# Altium schematic sheet RFID_Reader.SchDoc
size 297 x 209 mm; SheetNumber: 4; SheetTotal: 6
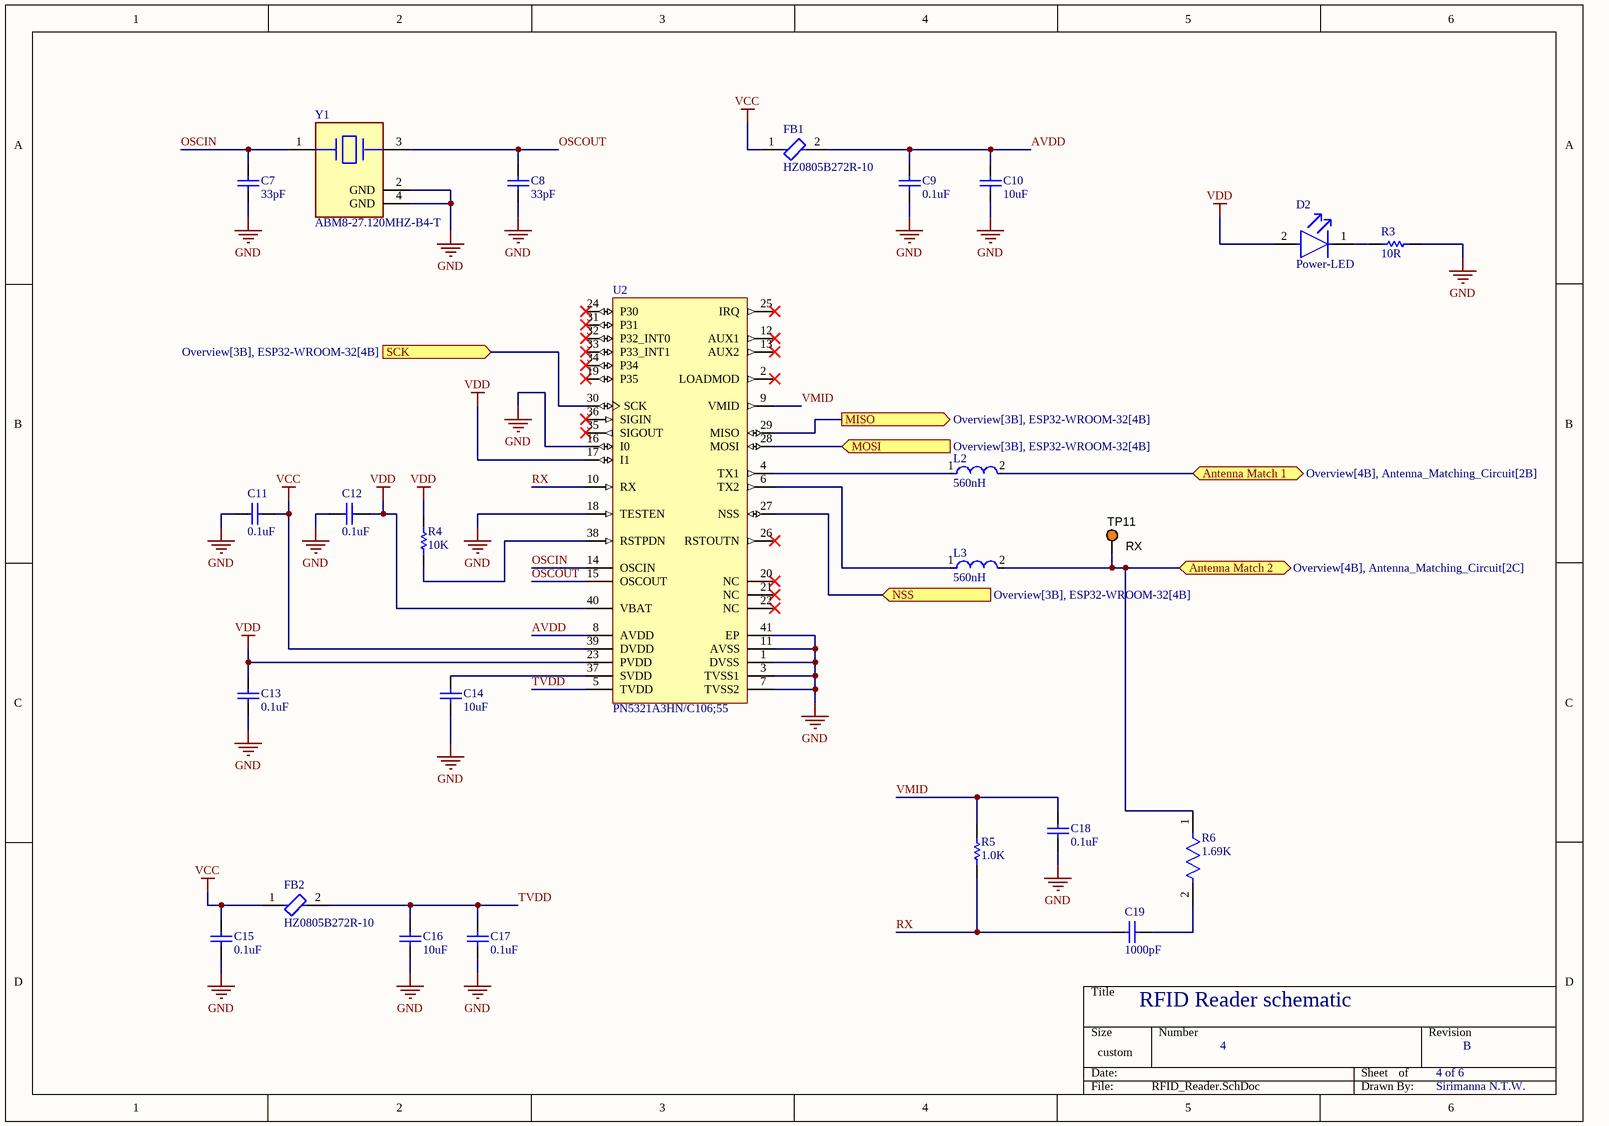
[diagram p0: RFID_Reader.SchDoc]

## Parts
C7  33pF  [CAPC2013X135X45NL10T25]
C8  33pF  [CAPC2013X135X45NL10T25]
C9  0.1uF  [CAPC2013X135X45NL10T25]
C10  10uF  [CAPC2013X135X45NL10T25]
C11  0.1uF  [CAPC2013X135X45NL10T25]
C12  0.1uF  [CAPC2013X135X45NL10T25]
C13  0.1uF  [CAPC2013X135X45NL10T25]
C14  10uF  [CAPC2013X135X45NL10T25]
C15  0.1uF  [CAPC2013X135X45NL10T25]
C16  10uF  [CAPC2013X135X45NL10T25]
C17  0.1uF  [CAPC2013X135X45NL10T25]
C18  0.1uF  [CAPC2013X135X45NL10T25]
C19  1000pF  [CAPC2013X135X45NL10T25]
D2  Power-LED  [FP-6_544-5255_01-4-MFG]
FB1  HZ0805B272R-10  [FP-MPZ2012-MFG]
FB2  HZ0805B272R-10  [FP-MPZ2012-MFG]
L2  560nH  [FP-LQM21DN_00-IPC_C]
L3  560nH  [FP-LQM21DN_00-IPC_C]
R3  10R  [RESC2013X60X35ML10T20]
R4  10K  [RESC2013X60X35NL10T20]
R5  1.0K  [RESC2013X50X30NL20T20]
R6  1.69K  [FP-CRCW0805-e3-MFG]
TP11  RX  [KSTN-5003]
U2  PN5321A3HN/C106;55  [NXP-HVQFN-40_L]
Y1  ABM8-27.120MHZ-B4-T  [FP-ABM8-MFG]

## Ports
Antenna Match 1 (bidir, see Overview[4B], Antenna_Matching_Circuit[2B]), Antenna Match 2 (bidir, see Overview[4B], Antenna_Matching_Circuit[2C]), MISO (out, see Overview[3B], ESP32-WROOM-32[4B]), MOSI (in, see Overview[3B], ESP32-WROOM-32[4B]), NSS (in, see Overview[3B], ESP32-WROOM-32[4B]), SCK (in, see Overview[3B], ESP32-WROOM-32[4B])

## Nets
GND: C7.1 C8.1 C9.1 C10.1 C11.2 C12.2 C13.1 C14.1 C15.1 C16.1 C17.1 C18.1 R3.2 U2.1(DVSS) U2.3(TVSS1) U2.7(TVSS2) U2.11(AVSS) U2.16(I0) U2.18(TESTEN) U2.41(EP) Y1.2(GND) Y1.4(GND)
VCC: C11.1 C15.2 FB1.1 FB2.1 U2.39(DVDD)
VDD: C12.1 C13.2 D2.2(A) R4.2 U2.17(I1) U2.23(PVDD) U2.40(VBAT)
Antenna Match 1: L2.2 ; port Antenna Match 1
Antenna Match 2: L3.2 R6.1 TP11.1 ; port Antenna Match 2
AVDD: C9.2 C10.2 FB1.2 U2.8(AVDD)
MISO: U2.29(MISO) ; port MISO
MOSI: U2.28(MOSI) ; port MOSI
NSS: U2.27(NSS) ; port NSS
OSCIN: C7.2 U2.14(OSCIN) Y1.1
OSCOUT: C8.2 U2.15(OSCOUT) Y1.3
RX: C19.1 R5.1 U2.10(RX)
SCK: U2.30(SCK) ; port SCK
TVDD: C16.2 C17.2 FB2.2 U2.5(TVDD)
VMID: C18.2 R5.2 U2.9(VMID)
NetC14_2: C14.2 U2.37(SVDD)
NetC19_2: C19.2 R6.2
NetD2_1: D2.1(C) R3.1
NetL2_1: L2.1 U2.4(TX1)
NetL3_1: L3.1 U2.6(TX2)
NetR4_1: R4.1 U2.38(RSTPDN)

Not connected (* = marked no-connect by the designer): U2 2(LOADMOD)* 12(AUX1)* 13(AUX2)* 19(P35)* 20(NC)* 21(NC)* 22(NC)* 24(P30)* 25(IRQ)* 26(RSTOUTN)* 31(P31)* 32(P32_INT0)* 33(P33_INT1)* 34(P34)* 35(SIGOUT)* 36(SIGIN)*

## Notes on the sheet
- RFID Reader schematic
- 4
- 4 of 6
- B
- Sirimanna N.T.W.

## Library data of the parts
C7-C19 = CMP-2100-03644-1: Chip Capacitor, 0.1 uF, +/- 10%, 50 V, -55 to 125 degC, 0805 (2012 Metric), RoHS, Tape and Reel; Manufacturer: Murata; Voltage: 50V; Capacitance: 100nF; Insulation Resistance: 10GR; Dielectric Material: Ceramic; Dielectric: X7R; Package Description: 2-Pin Surface Mount Device, Body 2 x 1.25 mm; Manufacturer URL: http://www.murata.com/; Case Code (Imperial): 0805; Datasheet URL: http://psearch.en.murata.com/capacitor/product/GRM21BR71H104KA01%23.pdf; Termination: SMD/SMT; Lead Free: LeadFree; Package Quantity: 1; Mount: SurfaceMount; REACH SVHC: Unknown; Thickness: 0.053inch; Height: 1.25mm; Case/Package: 0805; Voltage Rating: 50V; Width: 0.049inch; Case Code (Metric): 2012; Material: Ceramic; Min Operating Temperature: -55degC; RoHSCompliant: true; Datasheet Version: 42675.0; Voltage Rating (DC): 50V; Tolerance: 10%; Package Reference: 0805; Depth: 1.25mm; Length: 2mm; Max Operating Temperature: 125degC; Packaging: TapeandReel; Number of Pins: 2; Radiation Hardening: No
D2 = CMP-00030-55433990-1: TLLG4400 Led, Pcb, Green, 0.63MCD, 3MM, T-1, 7MA, 1.9V, 565NM, 25DEG, 20V, 20MW, -40; Lens Transparency: Diffused; Dominant Wavelength: 575nm; Test Current: 2mA; Viewing Angle: 50°; Lens Style: Circular, Colored, Diffused, Dome, Round; Number of LEDs: 1; Voltage Rating (DC): 2.4V; Luminous Intensity: 1.2mcd; Depth: 3.2mm; Wavelength: 575nm; Color: Green; Schedule B: 8541402000, 8541402000; RoHS: Compliant; Max Operating Temperature: 100°C; Power Dissipation: 20mW; Height: 4.5mm; Number of Pins: 2; Forward Voltage: 1.9V; NexarPartId: 55433990; Max Power Dissipation: 20mW; Length: 3.2mm; Forward Current: 2mA; Min Operating Temperature: -40°C; Illumination Color: Green; Lens Size: 3mm; Reverse Voltage: 20V; Mount: Through Hole; Case/Package: T; Radiation Hardening: No; Number of Elements: 1; REACH SVHC: Unknown; Lens Color: Green
FB1 FB2 = CMP-08257-000007-1: FERRITE BEAD 100 OHM 0805 1LN; Max Current Rating: 4A; Impedance: 100R; Tolerance: 25%; Test Frequency: 100MHz; DC Resistance (DCR): 20mR; Number of Lines: 1; Ratings: AEC-Q200; Height: 0.85mm; Length: 0.079inch; Max DC Current: 4A; Lead Free: Lead Free; Termination: SMD/SMT; Min Operating Temperature: -55°C; Mount: Surface Mount; Core Material: Ferrite; Packaging: Tape and Reel; Case Code (Imperial): 0805; Package Quantity: 4000; Depth: 1.25mm; Case/Package: 0805; Width: 1.25mm; Case Code (Metric): 2012; Max Operating Temperature: 125°C; Weight: 0.000194oz
L2 L3 = CMP-06042-016670-1: Multilayer Type Inductor for General Circuits, 0805 (2012), 0.56μH, 10%, 0.63Ω, 150mA; Core Material: Ferrite; Shielding: Shielded; Test Frequency: 25MHz; Q Factor: 25; DC Resistance (DCR): 630mR; Self Resonant Frequency: 140MHz; Military Standard: Not; Height: 0.85mm; Mount: Surface Mount; Radiation Hardening: No; Max DC Current: 150mA; Height - Seated (Max): 0.041inch; Lead Free: Lead Free; Width: 1.25mm; Case Code (Imperial): 0805; Packaging: Tape and Reel; Series: LQM21N; Tolerance: 10%; Termination: SMD/SMT; Case/Package: 0805; Case Code (Metric): 2012; Min Operating Temperature: -40°C; DC Current: 150mA; Max Operating Temperature: 85°C; Inductance: 560nH; Length: 2mm; Package Quantity: 4000; Current Rating: 150mA; Depth: 1.45mm; RoHS Compliant: Yes
R3 = CMP-2100-03670-1: Chip Resistor, 10 Ohm, +/- 1%, 0.125 W, -55 to 155 degC, 0805 (2012 Metric), RoHS, Tape and Reel; Manufacturer: Yageo; Resistance: 10Ohm; Power Rating: 125mW; Voltage Rating: 150V; Temperature Coefficient: 200ppm/degreesC; Number of Pins: 2; REACH SVHC: NoSVHC; Datasheet Version: Rev. 5, 10/2016; Max Operating Temperature: 155degC; Manufacturer URL: http://www.yageo.com/; Case Code (Imperial): 0805; Package Description: 2-Pin Surface Mounted Device, Body 2 x 1.25 mm; Case Code (Metric): 2012; Length: 2mm; RoHSCompliant: true; Max Power Dissipation: 125mW; Depth: 1.25mm; Packaging: TapeandReel; Height: 0.5mm; Package Reference: 0805; Package Quantity: 1; Tolerance: 1%; Termination: SMD/SMT; Min Operating Temperature: -55degC; Lead Free: LeadFree; Width: 1.25mm; Voltage Rating (DC): 150V; Datasheet URL: http://www.yageo.com/NewPortal/yageodocoutput?fileName=/pdf/R-Chip/PYu-RC_Group_51_RoHS_L_5.pdf; Composition: ThickFilm; Number of Terminations: 2; Case/Package: 0805
R4 = CMP-1659-00013-4: Chip Resistor, 10 KOhm, +/- 1%, 0.125 W, -55 to 155 degC, 0805 (2012 Metric), RoHS, Tape and Reel; Manufacturer: Yageo; Voltage Rating: 150 V; Mount: Surface Mount; ComponentLink1Description: Manufacturer URL; ComponentLink2URL: http://www.yageo.com/documents/recent/PYu-RC_Group_51_RoHS_L_04.pdf; Pins: 2; Length: 2 mm; Min Operating Temperature: -55 degC; Height: 0.5 mm; Mounting Technology: Surface Mount; RoHSCompliant: true; REACH SVHC: No SVHC; ComponentLink1URL: http://www.yageo.com/; Max Operating Temperature: 155 degC; PackageReference: 0805; DatasheetVersion: Rev. 4, 02/2016; Package Quantity: 5000; Packaging: Tape and Reel; ComponentLink2Description: Datasheet; PackageDescription: 2-Pin Surface Mounted Device, Body 2 x 1.25 mm
R5 = CMP-1013-00510-2: Part Number: CRCW08051K00FKEA; Manufacturer: Vishay Dale
R6 = CMP-2001-03615-2: RES Thick Film, 1.5kΩ, 1%, 0.125W, 100ppm/°C, 0805; Resistance: 1.5kR; Power Rating: 125mW; Voltage Rating: 150V; Features: Automotive AEC-Q200; Length: 2mm; Min Operating Temperature: -55°C; Width: 0.049inch; Tolerance: 1%; Temperature Coefficient: 100ppm/°C; Case Code (Imperial): 0805; Case Code (Metric): 2012; Package Quantity: 10; Number of Terminations: 2; Max Operating Temperature: 155°C; Military Standard: Not; Height: 0.45mm; Depth: 1.25mm; Lead Free: Lead Free; Packaging: Tape and Reel; Weight: 0.000194oz; Voltage Rating (DC): 150V; Composition: Thick Film; Radiation Hardening: No; Case/Package: 0805; Termination: SMD/SMT; Contact Plating: Tin; Max Power Dissipation: 125mW
TP11 = CMP-1672-00009-1: Test Point, Orange, 1-Pin THD, RoHS; Peak Reverse Current: 600 uA; Forward Current: 3 A; Max Surge Current: 80 A; Forward Voltage: 1.08 V; Max Operating Temperature: 150 degC; PackageReference: 5003; Pins: 2; ComponentLink2URL: http://keyelco.com/userAssets/file/M65p56.pdf; PackageDescription: 1-Pin Through Hole Device, Dia 2.54 mm; Weight: 0.01 lb; Diameter: 5.3 mm; Mount: Through Hole; Package Quantity: 500; Packaging: Bulk; Min Operating Temperature: -65 degC; ComponentLink1Description: Manufacturer URL; Height: 0.25 inch; ComponentLink1URL: http://www.keyelco.com/; ComponentLink2Description: Datasheet; Width: 0.25 inch; REACH SVHC: No SVHC; RoHSCompliant: true; Radiation Hardening: No; Length: 9.5 mm; DatasheetVersion: Jun-15
U2 = CMP-2000-05282-1: NFC Controller, 13.56 MHz, -30 to 85 degC, 40-Pin HVQFN (SOT618-1), RoHS, Tray; Manufacturer: NXP Semiconductors; Supply Voltage - Min: 2.7V; Supply Voltage - Max: 5.5V; Brand: NXPSemiconductors; Supply Current: 12uA; RoHS: Details; Mounting Style: SMD/SMT; Packaging: Tray; Operating Frequency: 13.56MHz; Maximum Operating Temperature: +85C; Product Category: RFWirelessMisc; Datasheet Version: Rev. 1.2, 03/2011; Type: NearFieldTransmissionModule,Read/Write; Package / Case: QFN-40; Datasheet URL: https://datasheet.ciiva.com/1172/1391932-1172875.pdf; Factory Pack Quantity: 490; Manufacturer URL: http://www.nxp.com/; Minimum Operating Temperature: -25C
Y1 = CMP-27762-000994-1: Crystal 27.12MHz ±30ppm 18pF SMD-4 3.2mm x 2.5mm; ESR (Equivalent Series Resistance): 50R; Frequency Stability: 50ppm; Capacitance: 1.8E-11F; Height: 0.031inch; Load Capacitance: 18pF; Width: 0.098inch; Packaging: Tape and Reel; Lead Free: Lead Free; Frequency Tolerance: 30ppm; Max Operating Temperature: 70°C; Length: 0.126inch; Case/Package: SMD/SMT; Mount: Surface Mount; Min Operating Temperature: -20°C; RoHS Compliant: Yes; Frequency: 27.12MHz